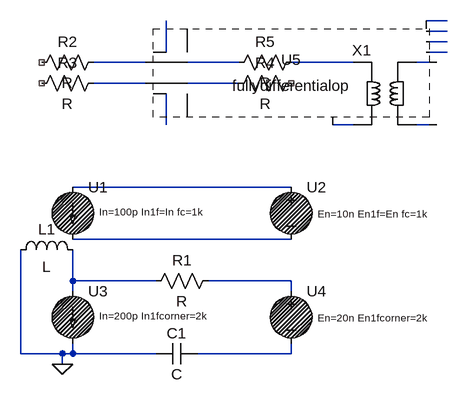
[diagram p0: schematic dev.asc]
dev.asc, the LTspice schematic file:
Version 4
SHEET 1 880 680
WIRE 560 -192 528 -192
WIRE 560 -176 528 -176
WIRE 560 -160 528 -160
WIRE 128 -144 128 -192
WIRE 160 -144 160 -160
WIRE 560 -144 528 -144
WIRE 96 -128 16 -128
WIRE 240 -128 160 -128
WIRE 416 -128 320 -128
WIRE 544 -128 512 -128
WIRE 96 -96 16 -96
WIRE 240 -96 160 -96
WIRE 160 -64 160 -80
WIRE 128 -32 128 -80
WIRE 416 -32 384 -32
WIRE 544 -32 512 -32
WIRE 320 64 -16 64
WIRE 320 144 -16 144
WIRE -16 208 -16 160
WIRE 112 208 -16 208
WIRE 320 208 192 208
WIRE -16 224 -16 208
WIRE 320 224 320 208
WIRE -96 320 -96 160
WIRE -32 320 -96 320
WIRE -16 320 -16 304
WIRE -16 320 -32 320
WIRE 112 320 -16 320
WIRE 320 320 320 304
WIRE 320 320 176 320
WIRE -32 336 -32 320
FLAG -32 336 0
SYMBOL circuiTikz\\noisecurrent -16 64 R0
SYMATTR InstName U1
SYMBOL circuiTikz\\noisevoltage 320 48 R0
SYMATTR InstName U2
SYMBOL circuiTikz\\noisecurrent -16 224 R0
SYMATTR InstName U3
SYMATTR SpiceLine In=200p In1fcorner=2k
SYMBOL circuiTikz\\noisevoltage 320 208 R0
SYMATTR InstName U4
SYMATTR SpiceLine En=20n En1fcorner=2k
SYMBOL res 208 192 R90
WINDOW 0 0 56 VBottom 2
WINDOW 3 32 56 VTop 2
SYMATTR InstName R1
SYMBOL cap 176 304 R90
WINDOW 0 0 32 VBottom 2
WINDOW 3 32 32 VTop 2
SYMATTR InstName C1
SYMBOL ind -112 176 R270
WINDOW 0 32 56 VTop 2
WINDOW 3 5 56 VBottom 2
SYMATTR InstName L1
SYMBOL OpAmps\\differential\\fullydifferentialop 128 -112 R0
SYMATTR InstName U5
SYMBOL res 32 -144 R90
WINDOW 0 0 56 VBottom 2
WINDOW 3 32 56 VTop 2
SYMATTR InstName R2
SYMBOL res 32 -112 R90
WINDOW 0 0 56 VBottom 2
WINDOW 3 32 56 VTop 2
SYMATTR InstName R3
SYMBOL res 336 -112 R90
WINDOW 0 0 56 VBottom 2
WINDOW 3 32 56 VTop 2
SYMATTR InstName R4
SYMBOL res 336 -144 R90
WINDOW 0 0 56 VBottom 2
WINDOW 3 32 56 VTop 2
SYMATTR InstName R5
SYMBOL circuiTikz\\transformer 464 -80 R0
SYMATTR InstName X1

The netlist it stands for:
* dev.asc
XU1 N017 N018 noisecurrentsource In=100p In1f=In fc=1k  ; pins + -
XU2 N017 N018 noisevoltagesource En=10n En1f=En fc=1k  ; pins + -
XU3 N019 0 noisecurrentsource In=200p In1fcorner=2k  ; pins + -
XU4 N020 N021 noisevoltagesource En=20n En1fcorner=2k  ; pins + -
R1 N020 N019 R
C1 N021 0 C
L1 0 N019 L
* U5: fullydifferentialop (symbol OpAmps\differential\fullydifferentialop not available, pin order unknown); nets seen at it: N001, N002, N003, N004, N005, N006, N007, N008, N010, N011, N012, N013, N014, N015, N016
R2 N007 NC_01 R
R3 N011 NC_02 R
R4 NC_03 N012 R
R5 N009 N008 R
XX1 N009 N015 N010 N016 transformer  ; pins p1 p2 s1 s2
.lib circuiTikz/noisecurrentsource.sub
.lib circuiTikz/noisevoltagesource.sub
.backanno
.end